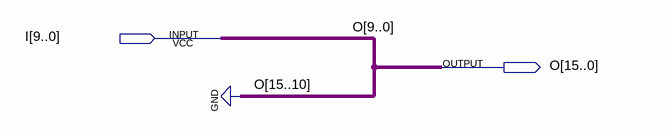
[diagram p0: schematic sheet]
// Quartus schematic extend10to16.bdf as structural Verilog: 0 symbols, 2 pins
module extend10to16 (
  input  [9:0] I,
  output [15:0] O
);


  assign O = {{6{1'b0}}, I};
endmodule
